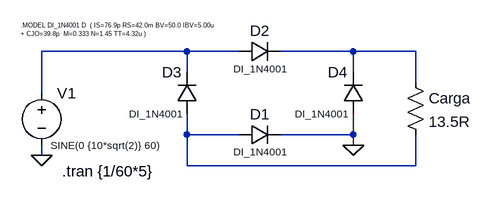
[diagram p0: schematic Diodo 1N4001 Retificador Onda Completa.asc]
Diodo 1N4001 Retificador Onda Completa.asc, the LTspice schematic file:
Version 4
SHEET 1 880 680
WIRE -48 -128 -272 -128
WIRE 32 -128 -48 -128
WIRE 208 -128 96 -128
WIRE 304 -128 208 -128
WIRE -48 -96 -48 -128
WIRE 208 -96 208 -128
WIRE 304 -80 304 -128
WIRE -272 -64 -272 -128
WIRE -48 0 -48 -32
WIRE 32 0 -48 0
WIRE 208 0 208 -32
WIRE 208 0 96 0
WIRE 208 16 208 0
WIRE -272 32 -272 16
WIRE -48 48 -48 0
WIRE 304 48 304 0
WIRE 304 48 -48 48
FLAG -272 32 0
FLAG 208 16 0
SYMBOL diode 32 16 R270
WINDOW 0 32 32 VTop 2
WINDOW 3 0 32 VBottom 1
SYMATTR InstName D1
SYMATTR Value DI_1N4001
SYMBOL voltage -272 -80 R0
WINDOW 3 14 96 Left 1
WINDOW 123 0 0 Left 0
WINDOW 39 0 0 Left 0
SYMATTR Value SINE(0 {10*sqrt(2)} 60)
SYMATTR InstName V1
SYMBOL res 288 -96 R0
SYMATTR InstName Carga
SYMATTR Value 13.5R
SYMBOL diode 32 -112 R270
WINDOW 0 32 32 VTop 2
WINDOW 3 0 32 VBottom 1
SYMATTR InstName D2
SYMATTR Value DI_1N4001
SYMBOL diode -32 -32 R180
WINDOW 0 24 64 Left 2
WINDOW 3 24 0 Left 1
SYMATTR InstName D3
SYMATTR Value DI_1N4001
SYMBOL diode 224 -32 R180
WINDOW 0 24 64 Left 2
WINDOW 3 24 0 Left 1
SYMATTR InstName D4
SYMATTR Value DI_1N4001
TEXT -240 56 Left 2 !.tran {1/60*5}
TEXT -304 -168 Left 0 !.MODEL DI_1N4001 D  ( IS=76.9p RS=42.0m BV=50.0 IBV=5.00u\n+ CJO=39.8p  M=0.333 N=1.45 TT=4.32u )

The netlist it stands for:
* Diodo 1N4001 Retificador Onda Completa.asc
D1 N003 0 DI_1N4001
V1 N001 0 SINE(0 {10*sqrt(2)} 60)
R§Carga N002 N003 13.5R
D2 N001 N002 DI_1N4001
D3 N003 N001 DI_1N4001
D4 0 N002 DI_1N4001
.model D D
.lib standard.dio
.tran {1/60*5}
.MODEL DI_1N4001 D  ( IS=76.9p RS=42.0m BV=50.0 IBV=5.00u
+ CJO=39.8p  M=0.333 N=1.45 TT=4.32u )
.backanno
.end